# Altium project ADCduinoModule.PrjPcb
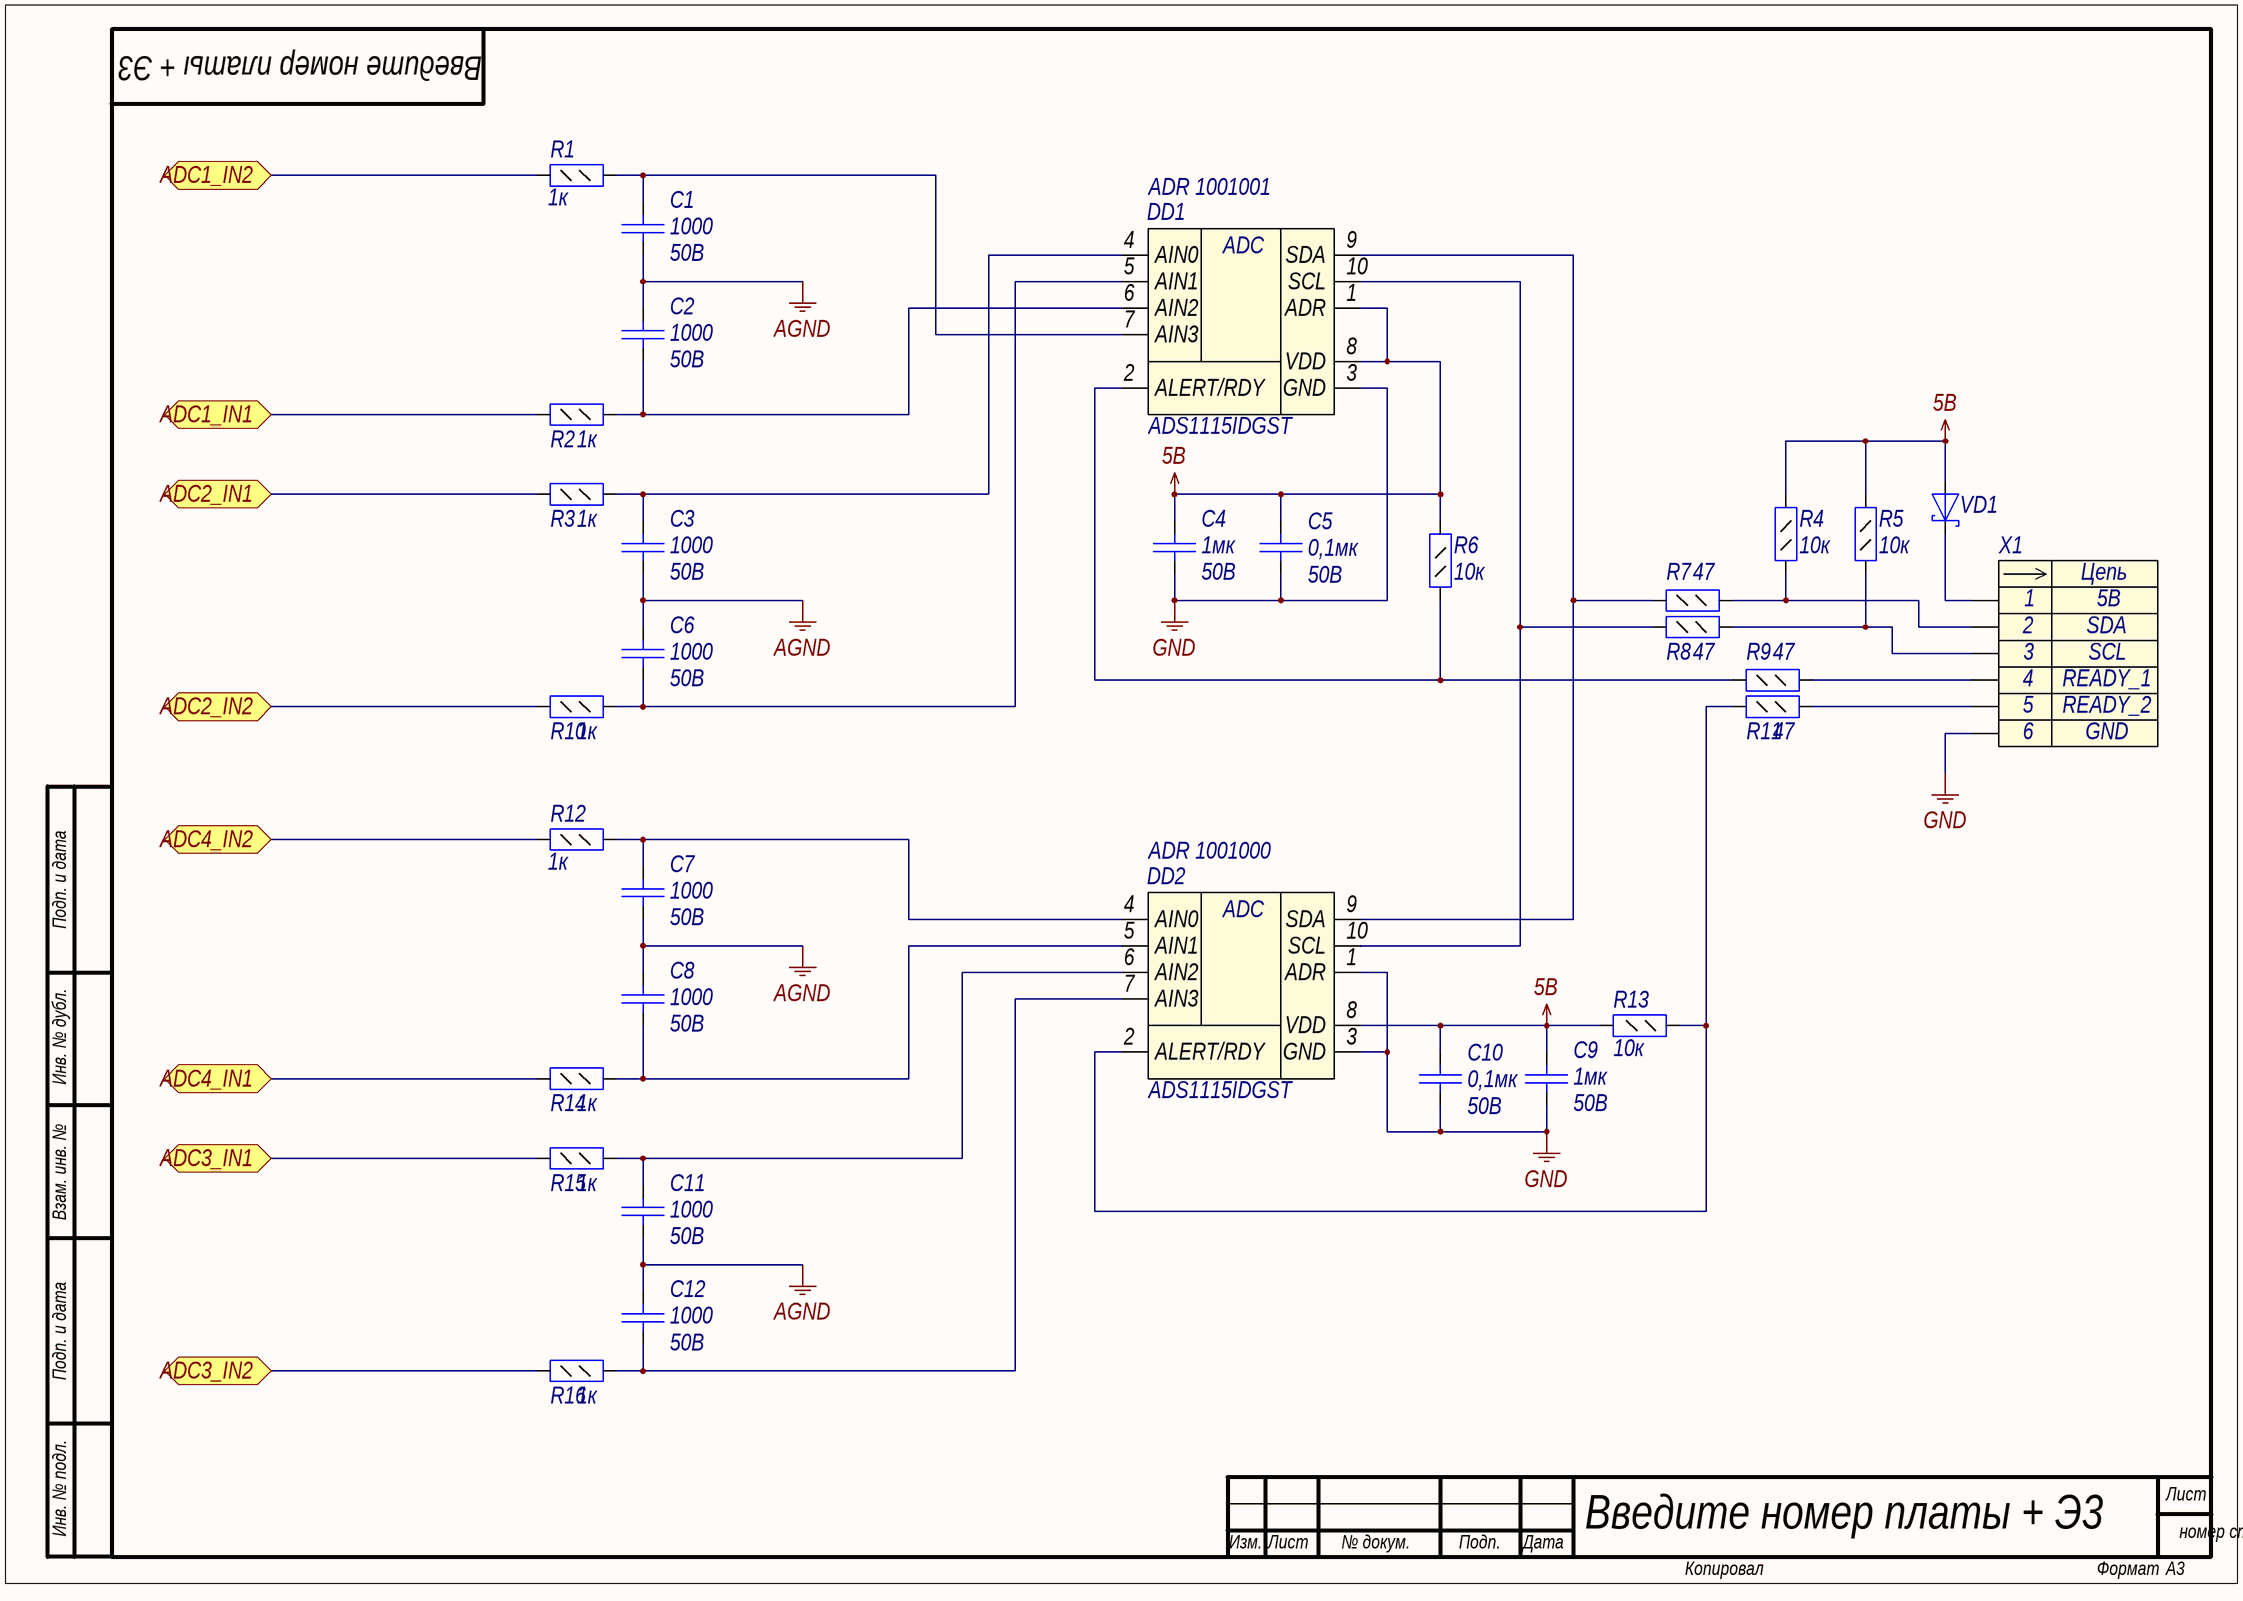
[diagram p0: ADCduinoModule_ADC.SchDoc]
4 sheets, 223 parts. Net scope: flat (ports and power ports of the same name join across sheets).
Board file: ADCduinoModule.PcbDoc
Sheets:
  ADCduinoModule_ADC.SchDoc
  ADCduinoModule_Power.SchDoc
  ADCduinoModule_Sensor_1.SchDoc
  ADCduinoModule_Sensor_2.SchDoc

## Sheet ADCduinoModule_ADC.SchDoc
size 420 x 297 mm; DocumentNumber: Введите номер платы + Э3; SheetNumber: номер страницы; Format: A3

### Parts
C1  value 1000  Voltage: 50В  [C0805]  (hidden comment: Capacitor)
C2  value 1000  Voltage: 50В  [C0805]  (hidden comment: Capacitor)
C3  value 1000  Voltage: 50В  [C0805]  (hidden comment: Capacitor)
C4  value 1мк  Voltage: 50B  [C0805]  (hidden comment: Capacitor)
C5  value 0,1мк  Voltage: 50B  [C0805]  (hidden comment: Capacitor)
C6  value 1000  Voltage: 50В  [C0805]  (hidden comment: Capacitor)
C7  value 1000  Voltage: 50В  [C0805]  (hidden comment: Capacitor)
C8  value 1000  Voltage: 50В  [C0805]  (hidden comment: Capacitor)
C9  value 1мк  Voltage: 50B  [C0805]  (hidden comment: Capacitor)
C10  value 0,1мк  Voltage: 50B  [C0805]  (hidden comment: Capacitor)
C11  value 1000  Voltage: 50В  [C0805]  (hidden comment: Capacitor)
C12  value 1000  Voltage: 50В  [C0805]  (hidden comment: Capacitor)
DD1  ADS1115IDGST  [MSOP10]
DD2  ADS1115IDGST  [MSOP10]
R1  value 1к  [R0805]  (hidden comment: Resistor_0,125Вт)
R2  value 1к  [R0805]  (hidden comment: Resistor_0,125Вт)
R3  value 1к  [R0805]  (hidden comment: Resistor_0,125Вт)
R4  value 10к  [R0805]  (hidden comment: Resistor_0,125Вт)
R5  value 10к  [R0805]  (hidden comment: Resistor_0,125Вт)
R6  value 10к  [R0805]  (hidden comment: Resistor_0,125Вт)
R7  value 47  [R0805]  (hidden comment: Resistor_0,125Вт)
R8  value 47  [R0805]  (hidden comment: Resistor_0,125Вт)
R9  value 47  [R0805]  (hidden comment: Resistor_0,125Вт)
R10  value 1к  [R0805]  (hidden comment: Resistor_0,125Вт)
R11  value 47  [R0805]  (hidden comment: Resistor_0,125Вт)
R12  value 1к  [R0805]  (hidden comment: Resistor_0,125Вт)
R13  value 10к  [R0805]  (hidden comment: Resistor_0,125Вт)
R14  value 1к  [R0805]  (hidden comment: Resistor_0,125Вт)
R15  value 1к  [R0805]  (hidden comment: Resistor_0,125Вт)
R16  value 1к  [R0805]  (hidden comment: Resistor_0,125Вт)
VD1  DiodeSchottky  [SMA]  (value not drawn)
X1  Header_6_plg  [PLS-6]  (value not drawn)

### Ports
ADC1_IN1, ADC1_IN2, ADC2_IN1, ADC2_IN2, ADC3_IN1, ADC3_IN2, ADC4_IN1, ADC4_IN2

### Nets
5B: C4.2 C5.2 C9.2 C10.2 DD1.1(ADR) DD1.8(VDD) DD2.8(VDD) R4.2 R5.2 R6.2 R13.2 VD1.2(A)
AGND: C1.1 C2.2 C3.1 C6.2 C7.1 C8.2 C11.1 C12.2
GND: C4.1 C5.1 C9.1 C10.1 DD1.3(GND) DD2.1(ADR) DD2.3(GND) X1.6
NetC1_2: C1.2 DD1.7(AIN3) R1.2
NetC2_1: C2.1 DD1.6(AIN2) R2.2
NetC3_2: C3.2 DD1.4(AIN0) R3.2
NetC6_1: C6.1 DD1.5(AIN1) R10.2
NetC7_2: C7.2 DD2.4(AIN0) R12.2
NetC8_1: C8.1 DD2.5(AIN1) R14.2
NetC11_2: C11.2 DD2.6(AIN2) R15.2
NetC12_1: C12.1 DD2.7(AIN3) R16.2
NetDA2_7: R1.1 ; port ADC1_IN2
NetDA3_7: R2.1 ; port ADC1_IN1
NetDA6_7: R10.1 ; port ADC2_IN2
NetDA7_7: R3.1 ; port ADC2_IN1
NetDA10_7: R16.1 ; port ADC3_IN2
NetDA11_7: R15.1 ; port ADC3_IN1
NetDA14_7: R12.1 ; port ADC4_IN2
NetDA15_7: R14.1 ; port ADC4_IN1
NetDD1_2: DD1.2(ALERT/RDY) R6.1 R9.1
NetDD1_9: DD1.9(SDA) DD2.9(SDA) R7.1
NetDD1_10: DD1.10(SCL) DD2.10(SCL) R8.1
NetDD2_2: DD2.2(ALERT/RDY) R11.1 R13.1
NetR4_1: R4.1 R7.2 X1.2
NetR5_1: R5.1 R8.2 X1.3
NetR9_2: R9.2 X1.4
NetR11_2: R11.2 X1.5
NetVD1_1: VD1.1(K) X1.1

### Notes on the sheet
- (near DD1) ADR 1001001
- (near DD2) ADR 1001000
- Подп. и дата
- Инв. № дубл.
- Взам. инв. №
- Инв. № подл.
- Лист
- Изм.
- № докум.
- Подп.
- Дата
- Копировал
- Формат
- (in symbol connect5) Цепь
- (in symbol interf6) ADC

### Library data of the parts
C1-C3 C6-C8 C11 C12 = cap165: Конденсатор; Part Name: Ceramic; Manufacture: Murata; Part Number: GRM216R71H102K*; id: cap165; TKE: X7R
C4 C9 = cap151: Конденсатор; Part Name: Ceramic; Manufacture: Murata; Part Number: GRM21BR71H105K; id: cap151; TKE: X7R
C5 C10 = cap141: Конденсатор; Part Name: Ceramic; Manufacture: Murata; Part Number: GRM21BR71H104K**; id: cap141; TKE: X7R
DD1 DD2 = interf6: Ultra-Small, Low-Power, 16-Bit  Analog-to-Digital Converter with Internal Reference; Part Name: ADC - I2C; Manufacture: Texas Instruments; Resolution: 16bit; Address: ADDR pin; Sample frequence: 0,86k; Number of Channel: 4; Input channel: 4single 2diff; Type Supply: Single Polar; Current Consumption: 150uA; Power Supply: 2-5.5V; id: interf6; Part Number: ADS1115IDGST
R1-R3 R10 R12 R14-R16 = res73: Резистор; Manufacture: Yageo; Part Number: RC0805FR-071KL; id: res73; Accuracy: 0,01; Part Name: Resistor; Power: 0,125Вт
R4-R6 R13 = res97: Резистор; Manufacture: Yageo; Part Number: RC0805FR-0710KL; id: res97; Accuracy: 0,01; Part Name: Resistor; Power: 0,125Вт
R7-R9 R11 = res41: Резистор; Manufacture: Yageo; Part Number: RC0805FR-0747RL; id: res41; Accuracy: 0,01; Part Name: Resistor; Power: 0,125Вт
VD1 = diode1: Диод Шоттки; Part Number: SK34A; Manufacture: Taiwan Semiconductor; id: diode1; Max Reverse Voltage: 40B; Forward Voltage: 0,55B; Forward Current: 3A; Part Name: Diode Schottky
X1 = connect5: Разъем - 6 конт. вилка; Part Number: DS1021-1*6SF112-B; Manufacture: Ningbo connfly electronic; Contact_1: 5B; Contact_2: SDA; Contact_3: SCL; Contact_4: READY_1; Contact_5: READY_2; Contact_6: GND; Etch: 2,54mm; Part Name: PLS-6; id: connect5

## Sheet ADCduinoModule_Power.SchDoc: Название платы
size 594 x 420 mm; ApprovedBy: Рогов; CheckedBy: Фамилия проверяющего; DrawnBy: Фамилия разработчика; DocumentNumber: Введите номер платы + Э3; SheetNumber: пусто если листов 1, иначе 1; SheetTotal: количество листов; Format: A2; DocumentType: тип схемы; Title1str: (вторая строка при необходимости); ImagePath: Введите номер платы
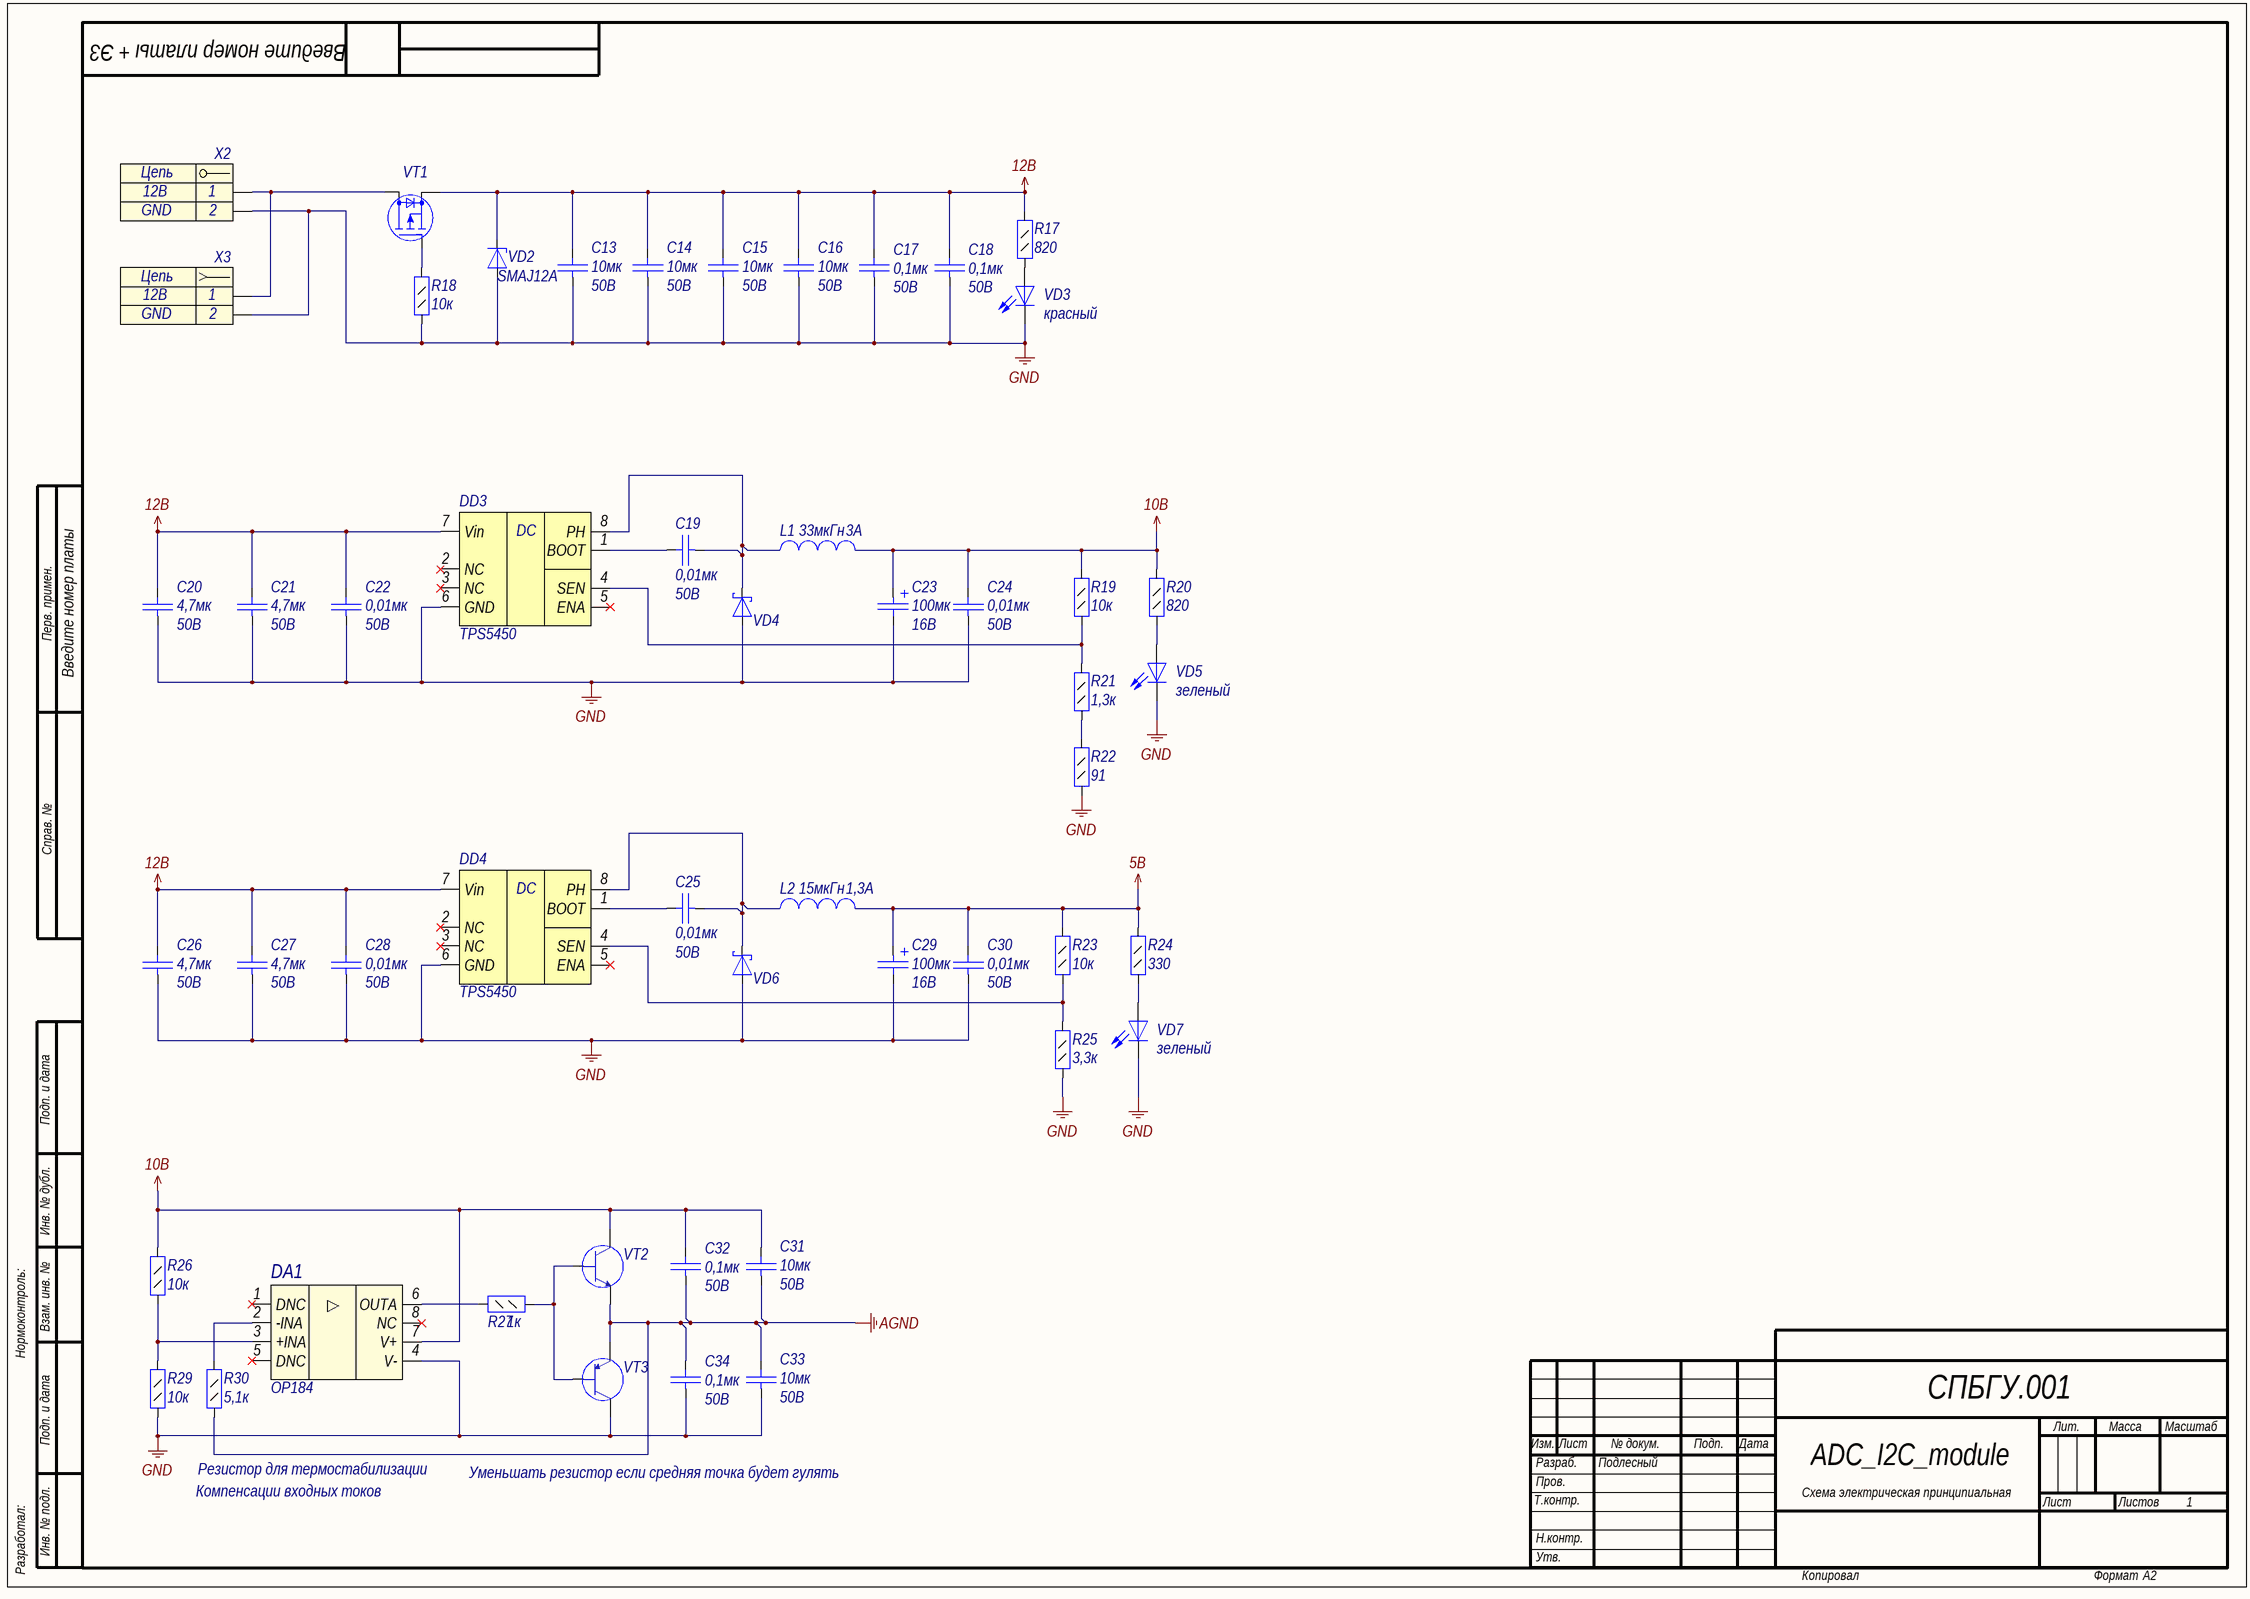
[diagram p1: ADCduinoModule_Power.SchDoc]

### Parts
C13  value 10мк  Voltage: 50В  [C1210]  (hidden comment: Capacitor)
C14  value 10мк  Voltage: 50В  [C1210]  (hidden comment: Capacitor)
C15  value 10мк  Voltage: 50В  [C1210]  (hidden comment: Capacitor)
C16  value 10мк  Voltage: 50В  [C1210]  (hidden comment: Capacitor)
C17  value 0,1мк  Voltage: 50B  [C0805]  (hidden comment: Capacitor)
C18  value 0,1мк  Voltage: 50B  [C0805]  (hidden comment: Capacitor)
C19  value 0,01мк  Voltage: 50B  [C0805]  (hidden comment: Capacitor)
C20  value 4,7мк  Voltage: 50В  [C1206]  (hidden comment: Capacitor)
C21  value 4,7мк  Voltage: 50В  [C1206]  (hidden comment: Capacitor)
C22  value 0,01мк  Voltage: 50B  [C0805]  (hidden comment: Capacitor)
C23  value 100мк  Voltage: 16В  [TANTAL CASE D]  (hidden comment: Capacitor_pol)
C24  value 0,01мк  Voltage: 50B  [C0805]  (hidden comment: Capacitor)
C25  value 0,01мк  Voltage: 50B  [C0805]  (hidden comment: Capacitor)
C26  value 4,7мк  Voltage: 50В  [C1206]  (hidden comment: Capacitor)
C27  value 4,7мк  Voltage: 50В  [C1206]  (hidden comment: Capacitor)
C28  value 0,01мк  Voltage: 50B  [C0805]  (hidden comment: Capacitor)
C29  value 100мк  Voltage: 16В  [TANTAL CASE D]  (hidden comment: Capacitor_pol)
C30  value 0,01мк  Voltage: 50B  [C0805]  (hidden comment: Capacitor)
C31  value 10мк  Voltage: 50В  [C1210]  (hidden comment: Capacitor)
C32  value 0,1мк  Voltage: 50B  [C0805]  (hidden comment: Capacitor)
C33  value 10мк  Voltage: 50В  [C1210]  (hidden comment: Capacitor)
C34  value 0,1мк  Voltage: 50B  [C0805]  (hidden comment: Capacitor)
DA1  OP184  [SO8]
DD3  TPS5450  [SO Powerpad8]
DD4  TPS5450  [SO Powerpad8]
L1  value 33мкГн  Rated Current: 3A  [IND_12.8x12.8]  (hidden comment: Inductor)
L2  value 15мкГн  Rated Current: 1,3A  [SDR0604]  (hidden comment: Inductor)
R17  value 820  [R0805]  (hidden comment: Resistor_0,125Вт)
R18  value 10к  [R0805]  (hidden comment: Resistor_0,125Вт)
R19  value 10к  [R0805]  (hidden comment: Resistor_0,125Вт)
R20  value 820  [R0805]  (hidden comment: Resistor_0,125Вт)
R21  value 1,3к  [R0805]  (hidden comment: Resistor_0,125Вт)
R22  value 91  [R0805]  (hidden comment: Resistor_0,125Вт)
R23  value 10к  [R0805]  (hidden comment: Resistor_0,125Вт)
R24  value 330  [R0805]  (hidden comment: Resistor_0,125Вт)
R25  value 3,3к  [R0805]  (hidden comment: Resistor_0,125Вт)
R26  value 10к  [R0805]  (hidden comment: Resistor_0,125Вт)
R27  value 1к  [R0805]  (hidden comment: Resistor_0,125Вт)
R29  value 10к  [R0805]  (hidden comment: Resistor_0,125Вт)
R30  value 5,1к  [R0805]  (hidden comment: Resistor_0,125Вт)
VD2  Part Number: SMAJ12A  [SMA]  (hidden comment: DiodeZener)
VD3  красный  [L_0805]
VD4  DiodeSchottky  [SMA]  (value not drawn)
VD5  зеленый  [L_0805]
VD6  DiodeSchottky  [SMA]  (value not drawn)
VD7  зеленый  [L_0805]
VT1  P-MOSFET  [DPAK]  (value not drawn)
VT2  BJT NPN  [SOT-223]  (value not drawn)
VT3  BJT PNP  [SOT-223]  (value not drawn)
X2  Header_2_trm  [TERMINAL-2WAY-3.5MM]  (value not drawn)
X3  Header_2_sct  [DS-210]  (value not drawn)

### Nets
5B: C29.1 C30.2 L2.2 R23.2 R24.2
10B: C23.1 C24.2 C31.2 C32.2 DA1.7(V+) L1.2 R19.2 R20.2 R26.2 VT2.3
12B: C13.2 C14.2 C15.2 C16.2 C17.2 C18.2 C20.2 C21.2 C22.2 C26.2 C27.2 C28.2 DD3.7(Vin) DD4.7(Vin) R17.2 VD2.1(K) VT1.3(S)
AGND: C31.1 C32.1 C33.2 C34.2 R30.1 VT2.2 VT3.2
GND: C13.1 C14.1 C15.1 C16.1 C17.1 C18.1 C20.1 C21.1 C22.1 C23.2 C24.1 C26.1 C27.1 C28.1 C29.2 C30.1 C33.1 C34.1 DA1.4(V-) DD3.6(GND) DD4.6(GND) R18.1 R22.1 R25.1 R29.1 VD2.2(A) VD3.1(K) VD4.2(A) VD5.1(K) VD6.2(A) VD7.1(K) VT3.3 X2.2 X3.2
NetC19_1: C19.1 DD3.8(PH) L1.1 VD4.1(K)
NetC19_2: C19.2 DD3.1(BOOT)
NetC25_1: C25.1 DD4.8(PH) L2.1 VD6.1(K)
NetC25_2: C25.2 DD4.1(BOOT)
NetDA1_2: DA1.2(-INA) R30.2
NetDA1_3: DA1.3(+INA) R26.1 R29.2
NetDA1_6: DA1.6(OUTA) R27.1
NetDD3_4: DD3.4(SEN) R19.1 R21.2
NetDD4_4: DD4.4(SEN) R23.1 R25.2
NetR17_1: R17.1 VD3.2(A)
NetR18_2: R18.2 VT1.1(G)
NetR20_1: R20.1 VD5.2(A)
NetR21_1: R21.1 R22.2
NetR24_1: R24.1 VD7.2(A)
NetR27_2: R27.2 VT2.1 VT3.1
NetVT1_2: VT1.2(D) X2.1 X3.1

Not connected (* = marked no-connect by the designer): DA1 1(DNC)* 5(DNC)* 8(NC)*; DD3 2(NC)* 3(NC)* 5(ENA)*; DD4 2(NC)* 3(NC)* 5(ENA)*

### Notes on the sheet
- Перв. примен.
- Справ. №
- Подп. и дата
- Инв. № дубл.
- Нормоконтроль:
- Взам. инв. №
- СПБГУ.001
- Изм.
- Лист
- № докум.
- Подп.
- Дата
- Лит.
- Масса
- Масштаб
- Компенсации входных токов
- Резистор для термостабилизации
- Уменьшать резистор если средняя точка будет гулять
- Т.контр.
- Пров.
- Разраб.
- Подлесный
- Схема электрическая принципиальная
- ADC_I2C_module
- Листов
- 1
- Разработал:
- Инв. № подл.
- Н.контр.
- Утв.
- Копировал
- Формат
- (in symbol connect1) Цепь
- (in symbol connect34) Цепь
- (in symbol pwr12) DC

### Library data of the parts
C13-C16 C31 C33 = cap205: Конденсатор; Part Name: Ceramic; Manufacture: Murata; Part Number: GRM32ER71H106K; id: cap205; TKE: X7R
C17 C18 C32 C34 = cap141: as C5 on sheet ADCduinoModule_ADC
C19 C22 C24 C25 C28 C30 = cap136: Конденсатор; Part Name: Ceramic; Manufacture: Murata; Part Number: GRM216R71H103K; id: cap136; TKE: X7R
C20 C21 C26 C27 = cap188: Конденсатор; Part Name: Ceramic; Manufacture: Murata; Part Number: GRM31CR71H475KA12L; id: cap188; TKE: X7R
C23 C29 = cap209: Конденсатор полярный; Part Name: Tantal; Manufacture: Vishay; Part Number: 293D107X9016D2TE3; id: cap209
DA1 = amp16: Precision Rail-to-Rail / Input and Output Operational Amplifiers; Part Number: OP184ESZ; Manufacture: Analog Devices; id: amp16; Rail-to-rail: yes; Supply Voltage: 3-36B; Supply Current max: 1,45mA; Bandwidth: 3,25MHz; Input Bias Current: 60nA; CMRR: 86dB; PSRR: 76dB; Offset voltage: 165uB; Channels: 1; Part Name: Precision Rail-to-Rail Input and Output
DD3 DD4 = pwr12: 5-A, Wide Input Range, Step-Down Converter; Manufacturer: Texas Instruments; id: pwr12; Input Voltage: 5,5 - 36B; Output Voltage: Adj; Current: 5A; Part Name: Step-Down Converter; Type: Impulse; Part Number: TPS5450
L1 = ind80: EMI Suppression Filter; Part Name: SMD Power Inductors; Part Number: B82477G4333M000; Manufacture: Epcos; id: ind80; Saturation Current: 3,5A; Resistance: 0,053Ohm
L2 = ind44: EMI Suppression Filter; Part Name: SMD Power Inductors; Part Number: SDR0604- 150YL; Manufacture: Bourns; id: ind44; Saturation Current: 1,6A; Resistance: 0,14Ohm
R17 R20 = res71: Резистор; Manufacture: Yageo; Part Number: RC0805FR-07820RL; id: res71; Accuracy: 0,01; Part Name: Resistor; Power: 0,125Вт
R18 R19 R23 R26 R29 = res97: as R4 on sheet ADCduinoModule_ADC; Part Name: Resistor; Power: 0,125Вт
R21 = res76: Резистор; Manufacture: Yageo; Part Number: RC0805FR-071K3; id: res76; Accuracy: 0,01; Part Name: Resistor; Power: 0,125Вт
R22 = res48: Резистор; Manufacture: Yageo; Part Number: RC0805FR-0791RL; id: res48; Accuracy: 0,01; Part Name: Resistor; Power: 0,125Вт
R24 = res61: Резистор; Manufacture: Yageo; Part Number: RC0805FR-07330RL; id: res61; Accuracy: 0,01; Part Name: Resistor; Power: 0,125Вт
R25 = res85: Резистор; Manufacture: Yageo; Part Number: RC0805FR-072K3; id: res85; Accuracy: 0,01; Part Name: Resistor; Power: 0,125Вт
R27 = res73: as R1 on sheet ADCduinoModule_ADC; Part Name: Resistor; Power: 0,125Вт
R30 = res90: Резистор; Manufacture: Yageo; Part Number: RC0805FR-075K1; id: res90; Accuracy: 0,01; Part Name: Resistor; Power: 0,125Вт
VD2 = SMAJ12A: Cтабилитрон (лавинный выпрямительный диод) односторонний; Part Name: TVS diode Unidirectional; Manufacture: ST Microelectronics; id: tvs128; Leakage Current: 0,2uA; Stand-off Voltage: 12B; Breakdown Voltage: 14B; Clamping voltage: 19,9B; Dynamic resistance: 0,259Ohm; Peak Pulse Power: 400W; Number of diodes: 1
VD3 = diode5: Светодиод; Part Number: KP-2012EC; id: diode5; Part Name: LED
VD4 VD6 = diode1: as VD1 on sheet ADCduinoModule_ADC; Part Name: Diode Schottky
VD5 VD7 = diode5: Светодиод; Part Number: KP-2012MGC; id: diode5; Part Name: LED
VT1 = trans8: N-MOSFET; Part Number: FDD6637; Manufacturer: Fairchild Semiconductor; id: trans8; Structure: p-channel; V drain-source max: (-35B); Rds: 0,0116Ohm; Gate-to-source voltage: (+-)25B; Continuous drain current: (-55)A; Pulsed drain current: (-100)A; Power dissipation: 57W
VT2 = bjt3: Part Name: Transistor; Part Number: PBSS4540Z.115; Manufacture: NXP Semiconductor; id: bjt3; hfe: 300; Vceo max: 40В; Ic max: 5А; Power: 2Вт; Frequency: 130МГц; Structure: npn
VT3 = bjt4: Part Name: Transistor; Part Number: PBSS5540Z.115; Manufacture: NXP Semiconductor; id: bjt4; hfe: 300; Vceo max: 40В; Ic max: 5А; Power: 2Вт; Frequency: 130МГц; Structure: pnp
X2 = connect34: Разъем - 2 конт. клеммник; Part Name: TERMINAL BLOCK 2 way; Contact_1: 12B; Contact_2: GND; Etch: 3.5mm; id: connect34
X3 = connect1: Разъем - 2 конт. розетка; Part Name: DC Power Jack; Part Number: DS-210B(PBT)(NB); Contact_1: 12B; Contact_2: GND; id: connect1

## Sheet ADCduinoModule_Sensor_1.SchDoc
size 594 x 420 mm; DocumentNumber: Введите номер платы + Э3; SheetNumber: номер страницы; Format: A2
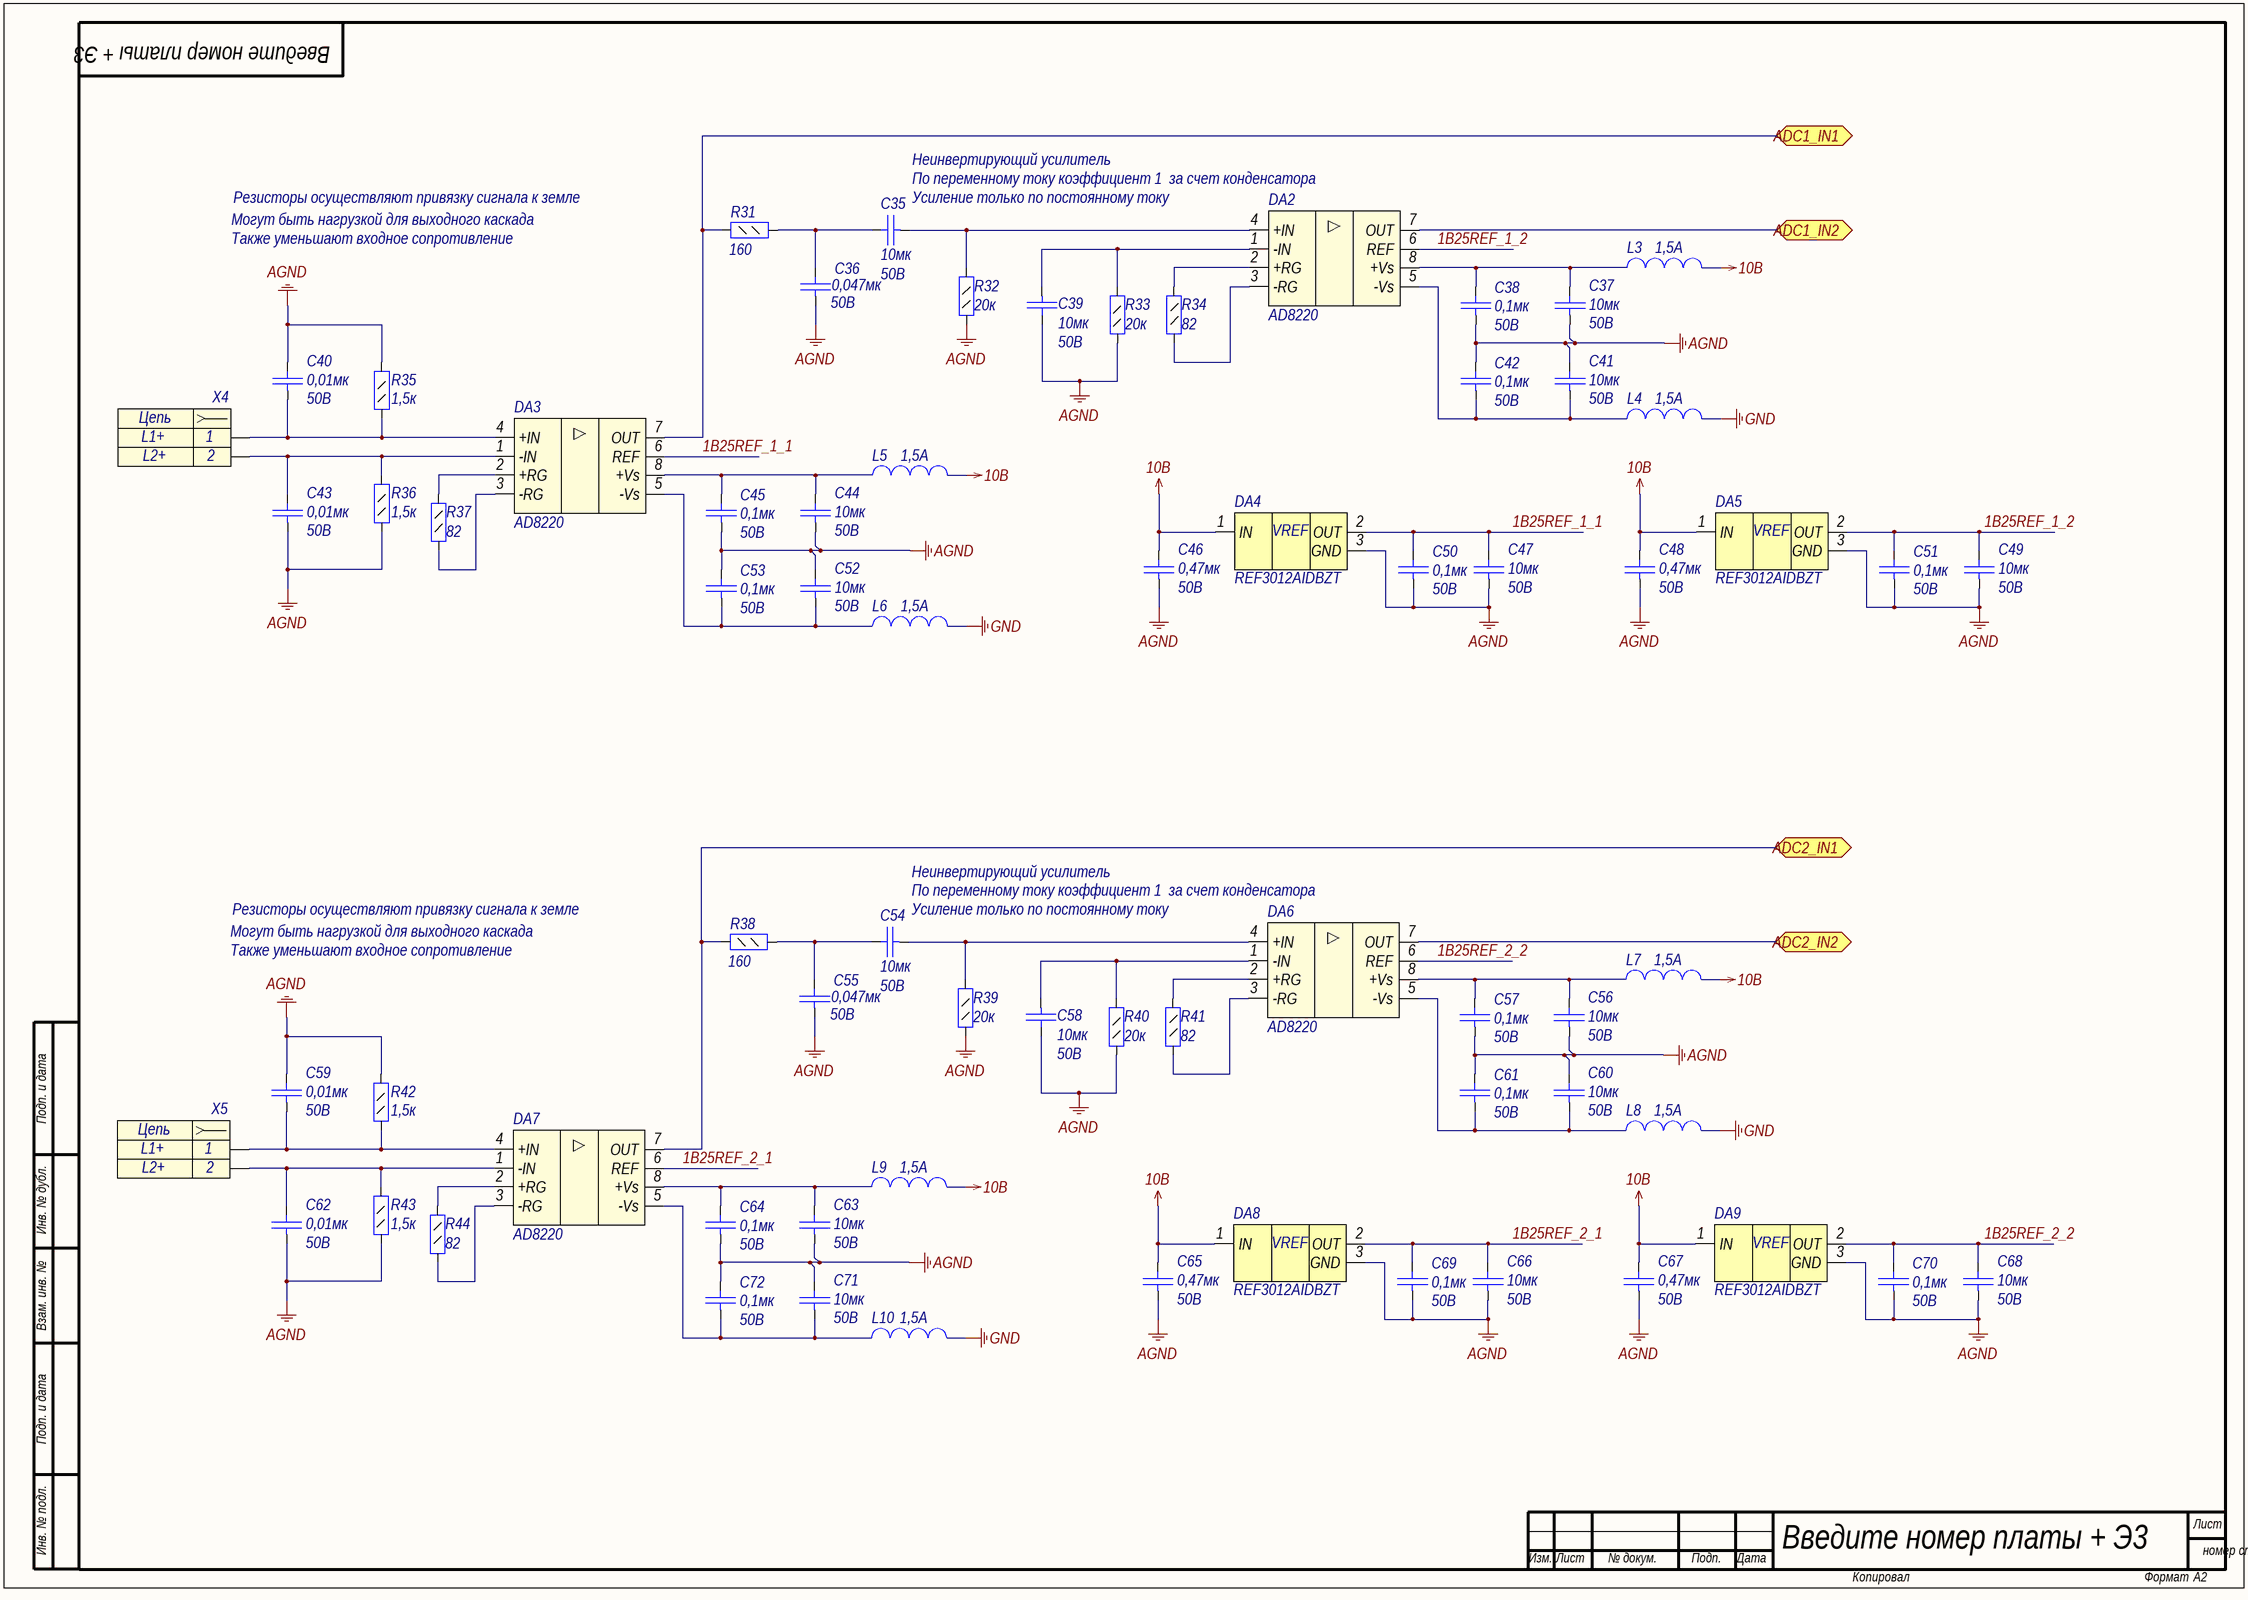
[diagram p2: ADCduinoModule_Sensor_1.SchDoc]

### Parts
C35  value 10мк  Voltage: 50В  [C1210]  (hidden comment: Capacitor)
C36  value 0,047мк  Voltage: 50B  [C0805]  (hidden comment: Capacitor)
C37  value 10мк  Voltage: 50В  [C1210]  (hidden comment: Capacitor)
C38  value 0,1мк  Voltage: 50B  [C0805]  (hidden comment: Capacitor)
C39  value 10мк  Voltage: 50В  [C1210]  (hidden comment: Capacitor)
C40  value 0,01мк  Voltage: 50B  [C0805]  (hidden comment: Capacitor)
C41  value 10мк  Voltage: 50В  [C1210]  (hidden comment: Capacitor)
C42  value 0,1мк  Voltage: 50B  [C0805]  (hidden comment: Capacitor)
C43  value 0,01мк  Voltage: 50B  [C0805]  (hidden comment: Capacitor)
C44  value 10мк  Voltage: 50В  [C1210]  (hidden comment: Capacitor)
C45  value 0,1мк  Voltage: 50B  [C0805]  (hidden comment: Capacitor)
C46  value 0,47мк  Voltage: 50B  [C0805]  (hidden comment: Capacitor)
C47  value 10мк  Voltage: 50В  [C1210]  (hidden comment: Capacitor)
C48  value 0,47мк  Voltage: 50B  [C0805]  (hidden comment: Capacitor)
C49  value 10мк  Voltage: 50В  [C1210]  (hidden comment: Capacitor)
C50  value 0,1мк  Voltage: 50B  [C0805]  (hidden comment: Capacitor)
C51  value 0,1мк  Voltage: 50B  [C0805]  (hidden comment: Capacitor)
C52  value 10мк  Voltage: 50В  [C1210]  (hidden comment: Capacitor)
C53  value 0,1мк  Voltage: 50B  [C0805]  (hidden comment: Capacitor)
C54  value 10мк  Voltage: 50В  [C1210]  (hidden comment: Capacitor)
C55  value 0,047мк  Voltage: 50B  [C0805]  (hidden comment: Capacitor)
C56  value 10мк  Voltage: 50В  [C1210]  (hidden comment: Capacitor)
C57  value 0,1мк  Voltage: 50B  [C0805]  (hidden comment: Capacitor)
C58  value 10мк  Voltage: 50В  [C1210]  (hidden comment: Capacitor)
C59  value 0,01мк  Voltage: 50B  [C0805]  (hidden comment: Capacitor)
C60  value 10мк  Voltage: 50В  [C1210]  (hidden comment: Capacitor)
C61  value 0,1мк  Voltage: 50B  [C0805]  (hidden comment: Capacitor)
C62  value 0,01мк  Voltage: 50B  [C0805]  (hidden comment: Capacitor)
C63  value 10мк  Voltage: 50В  [C1210]  (hidden comment: Capacitor)
C64  value 0,1мк  Voltage: 50B  [C0805]  (hidden comment: Capacitor)
C65  value 0,47мк  Voltage: 50B  [C0805]  (hidden comment: Capacitor)
C66  value 10мк  Voltage: 50В  [C1210]  (hidden comment: Capacitor)
C67  value 0,47мк  Voltage: 50B  [C0805]  (hidden comment: Capacitor)
C68  value 10мк  Voltage: 50В  [C1210]  (hidden comment: Capacitor)
C69  value 0,1мк  Voltage: 50B  [C0805]  (hidden comment: Capacitor)
C70  value 0,1мк  Voltage: 50B  [C0805]  (hidden comment: Capacitor)
C71  value 10мк  Voltage: 50В  [C1210]  (hidden comment: Capacitor)
C72  value 0,1мк  Voltage: 50B  [C0805]  (hidden comment: Capacitor)
DA2  AD8220  [MSOP8]
DA3  AD8220  [MSOP8]
DA4  Part Number: REF3012AIDBZT  [SOT23-3]  (hidden comment: REF30xx)
DA5  Part Number: REF3012AIDBZT  [SOT23-3]  (hidden comment: REF30xx)
DA6  AD8220  [MSOP8]
DA7  AD8220  [MSOP8]
DA8  Part Number: REF3012AIDBZT  [SOT23-3]  (hidden comment: REF30xx)
DA9  Part Number: REF3012AIDBZT  [SOT23-3]  (hidden comment: REF30xx)
L3  Rated Current: 1,5A  [L0603]  (hidden comment: Inductor)
L4  Rated Current: 1,5A  [L0603]  (hidden comment: Inductor)
L5  Rated Current: 1,5A  [L0603]  (hidden comment: Inductor)
L6  Rated Current: 1,5A  [L0603]  (hidden comment: Inductor)
L7  Rated Current: 1,5A  [L0603]  (hidden comment: Inductor)
L8  Rated Current: 1,5A  [L0603]  (hidden comment: Inductor)
L9  Rated Current: 1,5A  [L0603]  (hidden comment: Inductor)
L10  Rated Current: 1,5A  [L0603]  (hidden comment: Inductor)
R31  value 160  [R0805]  (hidden comment: Resistor_0,125Вт)
R32  value 20к  [R0805]  (hidden comment: Resistor_0,125Вт)
R33  value 20к  [R0805]  (hidden comment: Resistor_0,125Вт)
R34  value 82  [R0805]  (hidden comment: Resistor_0,125Вт)
R35  value 1,5к  [R0805]  (hidden comment: Resistor_0,125Вт)
R36  value 1,5к  [R0805]  (hidden comment: Resistor_0,125Вт)
R37  value 82  [R0805]  (hidden comment: Resistor_0,125Вт)
R38  value 160  [R0805]  (hidden comment: Resistor_0,125Вт)
R39  value 20к  [R0805]  (hidden comment: Resistor_0,125Вт)
R40  value 20к  [R0805]  (hidden comment: Resistor_0,125Вт)
R41  value 82  [R0805]  (hidden comment: Resistor_0,125Вт)
R42  value 1,5к  [R0805]  (hidden comment: Resistor_0,125Вт)
R43  value 1,5к  [R0805]  (hidden comment: Resistor_0,125Вт)
R44  value 82  [R0805]  (hidden comment: Resistor_0,125Вт)
X4  Header_2_sct  [TAB_2PAD]  (value not drawn)
X5  Header_2_sct  [TAB_2PAD]  (value not drawn)

### Ports
ADC1_IN1, ADC1_IN2, ADC2_IN1, ADC2_IN2

### Nets
10B: C46.2 C48.2 C65.2 C67.2 DA4.1(IN) DA5.1(IN) DA8.1(IN) DA9.1(IN) L3.2 L5.2 L7.2 L9.2
AGND: C36.1 C37.1 C38.1 C39.2 C40.2 C41.2 C42.2 C43.1 C44.1 C45.1 C46.1 C47.1 C48.1 C49.1 C50.1 C51.1 C52.2 C53.2 C55.1 C56.1 C57.1 C58.2 C59.2 C60.2 C61.2 C62.1 C63.1 C64.1 C65.1 C66.1 C67.1 C68.1 C69.1 C70.1 C71.2 C72.2 DA4.3(GND) DA5.3(GND) DA8.3(GND) DA9.3(GND) R32.1 R33.1 R35.2 R36.1 R39.1 R40.1 R42.2 R43.1
GND: L4.2 L6.2 L8.2 L10.2
1B25REF_1_1: C47.2 C50.2 DA3.6(REF) DA4.2(OUT)
1B25REF_1_2: C49.2 C51.2 DA2.6(REF) DA5.2(OUT)
1B25REF_2_1: C66.2 C69.2 DA7.6(REF) DA8.2(OUT)
1B25REF_2_2: C68.2 C70.2 DA6.6(REF) DA9.2(OUT)
NetC35_1: C35.1 DA2.4(+IN) R32.2
NetC35_2: C35.2 C36.2 R31.2
NetC37_2: C37.2 C38.2 DA2.8(+Vs) L3.1
NetC39_1: C39.1 DA2.1(-IN) R33.2
NetC40_1: C40.1 DA3.4(+IN) R35.1 X4.1
NetC41_1: C41.1 C42.1 DA2.5(-Vs) L4.1
NetC43_2: C43.2 DA3.1(-IN) R36.2 X4.2
NetC44_2: C44.2 C45.2 DA3.8(+Vs) L5.1
NetC52_1: C52.1 C53.1 DA3.5(-Vs) L6.1
NetC54_1: C54.1 DA6.4(+IN) R39.2
NetC54_2: C54.2 C55.2 R38.2
NetC56_2: C56.2 C57.2 DA6.8(+Vs) L7.1
NetC58_1: C58.1 DA6.1(-IN) R40.2
NetC59_1: C59.1 DA7.4(+IN) R42.1 X5.1
NetC60_1: C60.1 C61.1 DA6.5(-Vs) L8.1
NetC62_2: C62.2 DA7.1(-IN) R43.2 X5.2
NetC63_2: C63.2 C64.2 DA7.8(+Vs) L9.1
NetC71_1: C71.1 C72.1 DA7.5(-Vs) L10.1
NetDA2_2: DA2.2(+RG) R34.1
NetDA2_3: DA2.3(-RG) R34.2
NetDA2_7: DA2.7(OUT) ; port ADC1_IN2
NetDA3_2: DA3.2(+RG) R37.1
NetDA3_3: DA3.3(-RG) R37.2
NetDA3_7: DA3.7(OUT) R31.1 ; port ADC1_IN1
NetDA6_2: DA6.2(+RG) R41.1
NetDA6_3: DA6.3(-RG) R41.2
NetDA6_7: DA6.7(OUT) ; port ADC2_IN2
NetDA7_2: DA7.2(+RG) R44.1
NetDA7_3: DA7.3(-RG) R44.2
NetDA7_7: DA7.7(OUT) R38.1 ; port ADC2_IN1

### Notes on the sheet
- Неинвертирующий усилитель
- Резисторы осуществляют привязку сигнала к земле
- По переменному току коэффициент 1  за счет конденсатора
- (near C35) Усиление только по постоянному току
- Могут быть нагрузкой для выходного каскада
- Также уменьшают входное сопротивление
- (near C54) Усиление только по постоянному току
- Подп. и дата
- Инв. № дубл.
- Взам. инв. №
- Инв. № подл.
- Лист
- Изм.
- № докум.
- Подп.
- Дата
- Копировал
- Формат
- (in symbol connect57) Цепь
- (in symbol REF3012AIDBZT) VREF

### Library data of the parts
C35 C37 C39 C41 C44 C47 C49 C52 C54 C56 C58 C60 C63 C66 C68 C71 = cap205: as C13 on sheet ADCduinoModule_Power
C36 C55 = cap140: Конденсатор; Part Name: Ceramic; Manufacture: Murata; Part Number: GRM21BR71H473K; id: cap140; TKE: X7R
C38 C42 C45 C50 C51 C53 C57 C61 C64 C69 C70 C72 = cap141: as C5 on sheet ADCduinoModule_ADC
C40 C43 C59 C62 = cap136: as C19 on sheet ADCduinoModule_Power
C46 C48 C65 C67 = cap148: Конденсатор; Part Name: Ceramic; Manufacture: Murata; Part Number: GRM219R71C474K; id: cap148; TKE: X7R
DA2 DA3 DA6 DA7 = amp15: JFET Input Instrumentation Amplifier; Part Number: AD8220ARMZ; Manufacture: Analog Devices; id: amp15; Rail-to-rail: yes; Supply Voltage: 4,5В–36В or (+-)2,25В-(+-)18B; Supply Current max: 750uA; Bandwidth: 1,5MHz; Input Bias Current: 25pA; CMRR: 95dB; PSRR: 100dB; Offset voltage: (+-)0,125uB; Channels: 1; Part Name: JFET Input Instrumentation Amplifier
DA4 DA5 DA8 DA9 = REF3012AIDBZT: CMOS Voltage Reference; Manufacturer: Texas Instruments; id: ref2; Voltage min stabilize: 1,25B; Max input voltage: 5,5B; Accuracy: 0,002; Output current: 25mA; Part Name: CMOS Voltage Reference
L3-L10 = ind0: EMI Suppression Filter; Part Name: EMI Suppression Filters; Part Number: BLM18PG181SN1D; id: ind0; Resistance: 0,09Ohm
R31 R38 = res54: Резистор; Manufacture: Yageo; Part Number: RC0805FR-07160RL; id: res54; Accuracy: 0,01; Part Name: Resistor; Power: 0,125Вт
R32 R33 R39 R40 = res104: Резистор; Manufacture: Yageo; Part Number: RC0805FR-0720KL; id: res104; Accuracy: 0,01; Part Name: Resistor; Power: 0,125Вт
R34 R37 R41 R44 = res47: Резистор; Manufacture: Yageo; Part Number: RC0805FR-0782RL; id: res47; Accuracy: 0,01; Part Name: Resistor; Power: 0,125Вт
R35 R36 R42 R43 = res77: Резистор; Manufacture: Yageo; Part Number: RC0805FR-071K5; id: res77; Accuracy: 0,01; Part Name: Resistor; Power: 0,125Вт
X4 X5 = connect57: Разъем - 2 конт. розетка; Part Name: Place for wires; Contact_1: L1+; Contact_2: L2+; id: connect57

## Sheet ADCduinoModule_Sensor_2.SchDoc
size 594 x 420 mm; DocumentNumber: Введите номер платы + Э3; SheetNumber: номер страницы; Format: A2
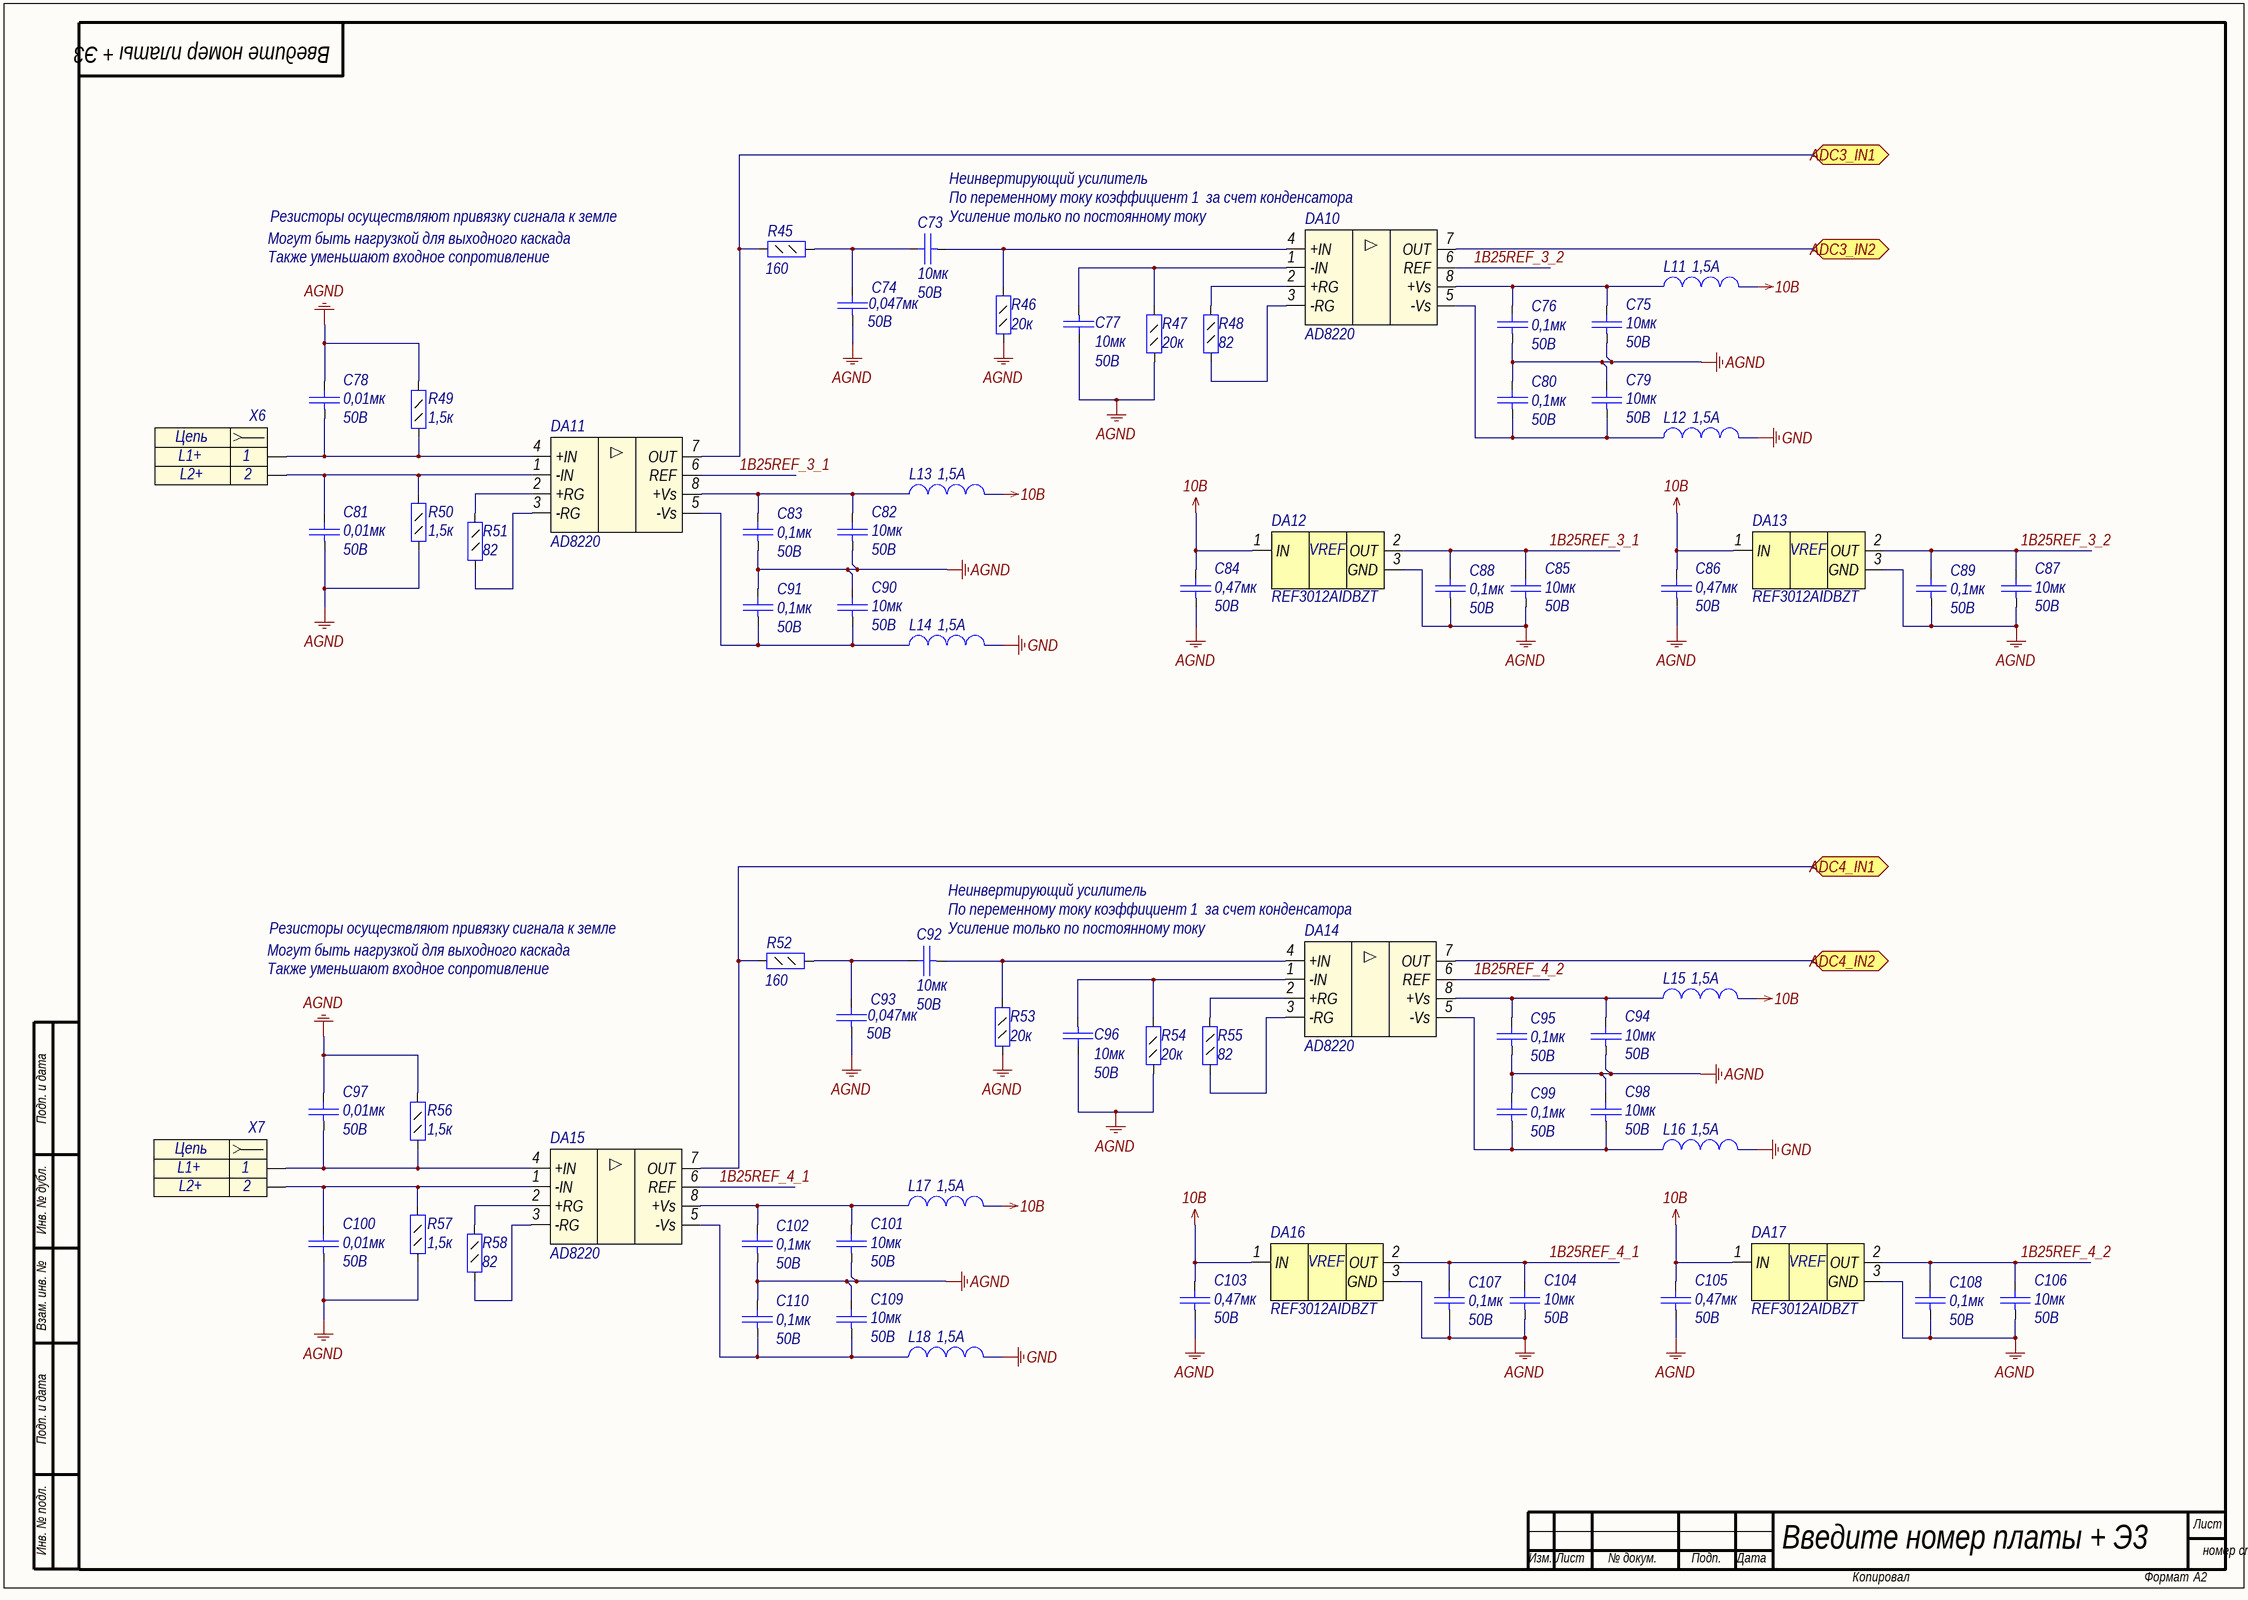
[diagram p3: ADCduinoModule_Sensor_2.SchDoc]

### Parts
C73  value 10мк  Voltage: 50В  [C1210]  (hidden comment: Capacitor)
C74  value 0,047мк  Voltage: 50B  [C0805]  (hidden comment: Capacitor)
C75  value 10мк  Voltage: 50В  [C1210]  (hidden comment: Capacitor)
C76  value 0,1мк  Voltage: 50B  [C0805]  (hidden comment: Capacitor)
C77  value 10мк  Voltage: 50В  [C1210]  (hidden comment: Capacitor)
C78  value 0,01мк  Voltage: 50B  [C0805]  (hidden comment: Capacitor)
C79  value 10мк  Voltage: 50В  [C1210]  (hidden comment: Capacitor)
C80  value 0,1мк  Voltage: 50B  [C0805]  (hidden comment: Capacitor)
C81  value 0,01мк  Voltage: 50B  [C0805]  (hidden comment: Capacitor)
C82  value 10мк  Voltage: 50В  [C1210]  (hidden comment: Capacitor)
C83  value 0,1мк  Voltage: 50B  [C0805]  (hidden comment: Capacitor)
C84  value 0,47мк  Voltage: 50B  [C0805]  (hidden comment: Capacitor)
C85  value 10мк  Voltage: 50В  [C1210]  (hidden comment: Capacitor)
C86  value 0,47мк  Voltage: 50B  [C0805]  (hidden comment: Capacitor)
C87  value 10мк  Voltage: 50В  [C1210]  (hidden comment: Capacitor)
C88  value 0,1мк  Voltage: 50B  [C0805]  (hidden comment: Capacitor)
C89  value 0,1мк  Voltage: 50B  [C0805]  (hidden comment: Capacitor)
C90  value 10мк  Voltage: 50В  [C1210]  (hidden comment: Capacitor)
C91  value 0,1мк  Voltage: 50B  [C0805]  (hidden comment: Capacitor)
C92  value 10мк  Voltage: 50В  [C1210]  (hidden comment: Capacitor)
C93  value 0,047мк  Voltage: 50B  [C0805]  (hidden comment: Capacitor)
C94  value 10мк  Voltage: 50В  [C1210]  (hidden comment: Capacitor)
C95  value 0,1мк  Voltage: 50B  [C0805]  (hidden comment: Capacitor)
C96  value 10мк  Voltage: 50В  [C1210]  (hidden comment: Capacitor)
C97  value 0,01мк  Voltage: 50B  [C0805]  (hidden comment: Capacitor)
C98  value 10мк  Voltage: 50В  [C1210]  (hidden comment: Capacitor)
C99  value 0,1мк  Voltage: 50B  [C0805]  (hidden comment: Capacitor)
C100  value 0,01мк  Voltage: 50B  [C0805]  (hidden comment: Capacitor)
C101  value 10мк  Voltage: 50В  [C1210]  (hidden comment: Capacitor)
C102  value 0,1мк  Voltage: 50B  [C0805]  (hidden comment: Capacitor)
C103  value 0,47мк  Voltage: 50B  [C0805]  (hidden comment: Capacitor)
C104  value 10мк  Voltage: 50В  [C1210]  (hidden comment: Capacitor)
C105  value 0,47мк  Voltage: 50B  [C0805]  (hidden comment: Capacitor)
C106  value 10мк  Voltage: 50В  [C1210]  (hidden comment: Capacitor)
C107  value 0,1мк  Voltage: 50B  [C0805]  (hidden comment: Capacitor)
C108  value 0,1мк  Voltage: 50B  [C0805]  (hidden comment: Capacitor)
C109  value 10мк  Voltage: 50В  [C1210]  (hidden comment: Capacitor)
C110  value 0,1мк  Voltage: 50B  [C0805]  (hidden comment: Capacitor)
DA10  AD8220  [MSOP8]
DA11  AD8220  [MSOP8]
DA12  Part Number: REF3012AIDBZT  [SOT23-3]  (hidden comment: REF30xx)
DA13  Part Number: REF3012AIDBZT  [SOT23-3]  (hidden comment: REF30xx)
DA14  AD8220  [MSOP8]
DA15  AD8220  [MSOP8]
DA16  Part Number: REF3012AIDBZT  [SOT23-3]  (hidden comment: REF30xx)
DA17  Part Number: REF3012AIDBZT  [SOT23-3]  (hidden comment: REF30xx)
L11  Rated Current: 1,5A  [L0603]  (hidden comment: Inductor)
L12  Rated Current: 1,5A  [L0603]  (hidden comment: Inductor)
L13  Rated Current: 1,5A  [L0603]  (hidden comment: Inductor)
L14  Rated Current: 1,5A  [L0603]  (hidden comment: Inductor)
L15  Rated Current: 1,5A  [L0603]  (hidden comment: Inductor)
L16  Rated Current: 1,5A  [L0603]  (hidden comment: Inductor)
L17  Rated Current: 1,5A  [L0603]  (hidden comment: Inductor)
L18  Rated Current: 1,5A  [L0603]  (hidden comment: Inductor)
R45  value 160  [R0805]  (hidden comment: Resistor_0,125Вт)
R46  value 20к  [R0805]  (hidden comment: Resistor_0,125Вт)
R47  value 20к  [R0805]  (hidden comment: Resistor_0,125Вт)
R48  value 82  [R0805]  (hidden comment: Resistor_0,125Вт)
R49  value 1,5к  [R0805]  (hidden comment: Resistor_0,125Вт)
R50  value 1,5к  [R0805]  (hidden comment: Resistor_0,125Вт)
R51  value 82  [R0805]  (hidden comment: Resistor_0,125Вт)
R52  value 160  [R0805]  (hidden comment: Resistor_0,125Вт)
R53  value 20к  [R0805]  (hidden comment: Resistor_0,125Вт)
R54  value 20к  [R0805]  (hidden comment: Resistor_0,125Вт)
R55  value 82  [R0805]  (hidden comment: Resistor_0,125Вт)
R56  value 1,5к  [R0805]  (hidden comment: Resistor_0,125Вт)
R57  value 1,5к  [R0805]  (hidden comment: Resistor_0,125Вт)
R58  value 82  [R0805]  (hidden comment: Resistor_0,125Вт)
X6  Header_2_sct  [TAB_2PAD]  (value not drawn)
X7  Header_2_sct  [TAB_2PAD]  (value not drawn)

### Ports
ADC3_IN1, ADC3_IN2, ADC4_IN1, ADC4_IN2

### Nets
10B: C84.2 C86.2 C103.2 C105.2 DA12.1(IN) DA13.1(IN) DA16.1(IN) DA17.1(IN) L11.2 L13.2 L15.2 L17.2
AGND: C74.1 C75.1 C76.1 C77.2 C78.2 C79.2 C80.2 C81.1 C82.1 C83.1 C84.1 C85.1 C86.1 C87.1 C88.1 C89.1 C90.2 C91.2 C93.1 C94.1 C95.1 C96.2 C97.2 C98.2 C99.2 C100.1 C101.1 C102.1 C103.1 C104.1 C105.1 C106.1 C107.1 C108.1 C109.2 C110.2 DA12.3(GND) DA13.3(GND) DA16.3(GND) DA17.3(GND) R46.1 R47.1 R49.2 R50.1 R53.1 R54.1 R56.2 R57.1
GND: L12.2 L14.2 L16.2 L18.2
1B25REF_3_1: C85.2 C88.2 DA11.6(REF) DA12.2(OUT)
1B25REF_3_2: C87.2 C89.2 DA10.6(REF) DA13.2(OUT)
1B25REF_4_1: C104.2 C107.2 DA15.6(REF) DA16.2(OUT)
1B25REF_4_2: C106.2 C108.2 DA14.6(REF) DA17.2(OUT)
NetC73_1: C73.1 DA10.4(+IN) R46.2
NetC73_2: C73.2 C74.2 R45.2
NetC75_2: C75.2 C76.2 DA10.8(+Vs) L11.1
NetC77_1: C77.1 DA10.1(-IN) R47.2
NetC78_1: C78.1 DA11.4(+IN) R49.1 X6.1
NetC79_1: C79.1 C80.1 DA10.5(-Vs) L12.1
NetC81_2: C81.2 DA11.1(-IN) R50.2 X6.2
NetC82_2: C82.2 C83.2 DA11.8(+Vs) L13.1
NetC90_1: C90.1 C91.1 DA11.5(-Vs) L14.1
NetC92_1: C92.1 DA14.4(+IN) R53.2
NetC92_2: C92.2 C93.2 R52.2
NetC94_2: C94.2 C95.2 DA14.8(+Vs) L15.1
NetC96_1: C96.1 DA14.1(-IN) R54.2
NetC97_1: C97.1 DA15.4(+IN) R56.1 X7.1
NetC98_1: C98.1 C99.1 DA14.5(-Vs) L16.1
NetC100_2: C100.2 DA15.1(-IN) R57.2 X7.2
NetC101_2: C101.2 C102.2 DA15.8(+Vs) L17.1
NetC109_1: C109.1 C110.1 DA15.5(-Vs) L18.1
NetDA10_2: DA10.2(+RG) R48.1
NetDA10_3: DA10.3(-RG) R48.2
NetDA10_7: DA10.7(OUT) ; port ADC3_IN2
NetDA11_2: DA11.2(+RG) R51.1
NetDA11_3: DA11.3(-RG) R51.2
NetDA11_7: DA11.7(OUT) R45.1 ; port ADC3_IN1
NetDA14_2: DA14.2(+RG) R55.1
NetDA14_3: DA14.3(-RG) R55.2
NetDA14_7: DA14.7(OUT) ; port ADC4_IN2
NetDA15_2: DA15.2(+RG) R58.1
NetDA15_3: DA15.3(-RG) R58.2
NetDA15_7: DA15.7(OUT) R52.1 ; port ADC4_IN1

### Notes on the sheet
- Неинвертирующий усилитель
- По переменному току коэффициент 1  за счет конденсатора
- Могут быть нагрузкой для выходного каскада
- Также уменьшают входное сопротивление
- Резисторы осуществляют привязку сигнала к земле
- (near C73) Усиление только по постоянному току
- (near C92) Усиление только по постоянному току
- Подп. и дата
- Инв. № дубл.
- Взам. инв. №
- Инв. № подл.
- Лист
- Изм.
- № докум.
- Подп.
- Дата
- Копировал
- Формат
- (in symbol connect57) Цепь
- (in symbol REF3012AIDBZT) VREF

### Library data of the parts
C73 C75 C77 C79 C82 C85 C87 C90 C92 C94 C96 C98 C101 C104 C106 C109 = cap205: as C13 on sheet ADCduinoModule_Power
C74 C93 = cap140: as C36 on sheet ADCduinoModule_Sensor_1
C76 C80 C83 C88 C89 C91 C95 C99 C102 C107 C108 C110 = cap141: as C5 on sheet ADCduinoModule_ADC
C78 C81 C97 C100 = cap136: as C19 on sheet ADCduinoModule_Power
C84 C86 C103 C105 = cap148: as C46 on sheet ADCduinoModule_Sensor_1
DA10 DA11 DA14 DA15 = amp15: as DA2 on sheet ADCduinoModule_Sensor_1; Part Name: JFET Input Instrumentation Amplifier
DA12 DA13 DA16 DA17 = REF3012AIDBZT: as DA4 on sheet ADCduinoModule_Sensor_1; Part Name: CMOS Voltage Reference
L11-L18 = ind0: as L3 on sheet ADCduinoModule_Sensor_1
R45 R52 = res54: as R31 on sheet ADCduinoModule_Sensor_1; Part Name: Resistor; Power: 0,125Вт
R46 R47 R53 R54 = res104: as R32 on sheet ADCduinoModule_Sensor_1; Part Name: Resistor; Power: 0,125Вт
R48 R51 R55 R58 = res47: as R34 on sheet ADCduinoModule_Sensor_1; Part Name: Resistor; Power: 0,125Вт
R49 R50 R56 R57 = res77: as R35 on sheet ADCduinoModule_Sensor_1; Part Name: Resistor; Power: 0,125Вт
X6 X7 = connect57: as X4 on sheet ADCduinoModule_Sensor_1; id: connect57

## Nets that join several sheets
5B: ADCduinoModule_ADC (12 pins), ADCduinoModule_Power (5 pins)
10B: ADCduinoModule_Power (10 pins), ADCduinoModule_Sensor_1 (12 pins), ADCduinoModule_Sensor_2 (12 pins)
AGND: ADCduinoModule_ADC (8 pins), ADCduinoModule_Power (7 pins), ADCduinoModule_Sensor_1 (48 pins), ADCduinoModule_Sensor_2 (48 pins)
GND: ADCduinoModule_ADC (8 pins), ADCduinoModule_Power (34 pins), ADCduinoModule_Sensor_1 (L4.2 L6.2 L8.2 L10.2), ADCduinoModule_Sensor_2 (L12.2 L14.2 L16.2 L18.2)
NetDA2_7: ADCduinoModule_ADC (R1.1), ADCduinoModule_Sensor_1 (DA2.7)
NetDA3_7: ADCduinoModule_ADC (R2.1), ADCduinoModule_Sensor_1 (DA3.7 R31.1)
NetDA6_7: ADCduinoModule_ADC (R10.1), ADCduinoModule_Sensor_1 (DA6.7)
NetDA7_7: ADCduinoModule_ADC (R3.1), ADCduinoModule_Sensor_1 (DA7.7 R38.1)
NetDA10_7: ADCduinoModule_ADC (R16.1), ADCduinoModule_Sensor_2 (DA10.7)
NetDA11_7: ADCduinoModule_ADC (R15.1), ADCduinoModule_Sensor_2 (DA11.7 R45.1)
NetDA14_7: ADCduinoModule_ADC (R12.1), ADCduinoModule_Sensor_2 (DA14.7)
NetDA15_7: ADCduinoModule_ADC (R14.1), ADCduinoModule_Sensor_2 (DA15.7 R52.1)